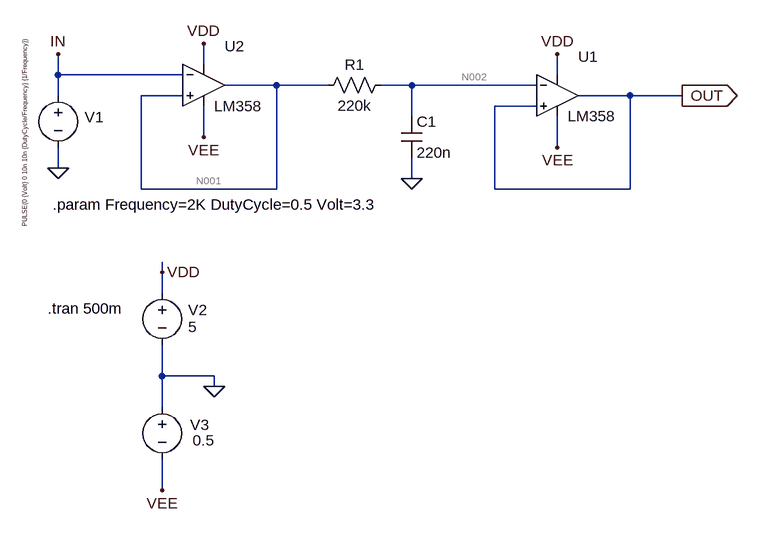
[diagram p0: schematic v1.0.asc]
v1.0.asc, the LTspice schematic file:
Version 4.1
SHEET 1 972 828
WIRE -48 80 -48 48
WIRE -272 96 -272 64
WIRE -80 96 -272 96
WIRE 496 96 496 64
WIRE 64 112 -16 112
WIRE 144 112 64 112
WIRE 272 112 224 112
WIRE 464 112 272 112
WIRE -272 128 -272 96
WIRE -80 128 -144 128
WIRE 608 128 528 128
WIRE 688 128 608 128
WIRE 464 144 400 144
WIRE 272 160 272 112
WIRE -48 192 -48 144
WIRE 496 208 496 160
WIRE -272 240 -272 208
WIRE 272 256 272 224
WIRE -144 272 -144 128
WIRE 64 272 64 112
WIRE 64 272 -144 272
WIRE 400 272 400 144
WIRE 608 272 608 128
WIRE 608 272 400 272
WIRE -112 400 -112 384
WIRE -112 432 -112 400
WIRE -112 560 -112 512
WIRE -32 560 -112 560
WIRE -32 576 -32 560
WIRE -112 608 -112 560
WIRE -112 736 -112 688
FLAG -272 240 0
FLAG 272 256 0
FLAG -272 64 IN
FLAG 688 128 OUT
IOPIN 688 128 Out
FLAG -112 400 VDD
FLAG 496 64 VDD
FLAG -48 48 VDD
FLAG -32 576 0
FLAG 496 208 VEE
FLAG -48 192 VEE
FLAG -112 736 VEE
SYMBOL voltage -272 112 R0
WINDOW 0 41 49 Left 2
WINDOW 3 -51 -74 VRight 0
WINDOW 123 0 0 Left 0
WINDOW 39 0 0 Left 0
SYMATTR InstName V1
SYMATTR Value PULSE(0 {Volt} 0 10n 10n {DutyCycle/Frequency} {1/Frequency})
SYMBOL res 240 96 R90
WINDOW 0 0 56 VBottom 2
WINDOW 3 32 56 VTop 2
SYMATTR InstName R1
SYMATTR Value 220k
SYMBOL cap 256 160 R0
SYMATTR InstName C1
SYMATTR Value 220n
SYMBOL voltage -112 416 R0
WINDOW 0 40 42 Left 2
WINDOW 3 40 68 Left 2
WINDOW 123 0 0 Left 0
WINDOW 39 0 0 Left 0
SYMATTR InstName V2
SYMATTR Value 5
SYMBOL MyLib\\OpAmp\\LM358 496 64 R0
WINDOW 0 32 4 Left 2
WINDOW 38 35 31 Left 2
SYMATTR InstName U1
SYMBOL MyLib\\OpAmp\\LM358 -48 48 R0
WINDOW 0 32 4 Left 2
WINDOW 38 35 31 Left 2
SYMATTR InstName U2
SYMBOL voltage -112 592 R0
WINDOW 0 43 43 Left 2
WINDOW 3 47 67 Left 2
WINDOW 123 0 0 Left 0
WINDOW 39 0 0 Left 0
SYMATTR InstName V3
SYMATTR Value 0.5
TEXT -280 296 Left 2 !.param Frequency=2K DutyCycle=0.5 Volt=3.3
TEXT -288 456 Left 2 !.tran 500m

The netlist it stands for:
* v1.0.asc
V1 IN 0 PULSE(0 {Volt} 0 10n 10n {DutyCycle/Frequency} {1/Frequency})
R1 N002 N001 220k
C1 N002 0 220n
V2 VDD 0 5
* U1: LM358 (symbol MyLib\OpAmp\LM358 not available, pins judged from their places): In+=OUT In-=N002 V+=VDD V-=VEE OUT=OUT
* U2: LM358 (symbol MyLib\OpAmp\LM358 not available, pins judged from their places): In+=N001 In-=IN V+=VDD V-=VEE OUT=N001
V3 0 VEE 0.5
.param Frequency=2K DutyCycle=0.5 Volt=3.3
.tran 500m
.backanno
.end

* Results of the author's LTspice run, read from the files saved beside the schematic
* Operating Point, zero values left out:
*   V(n001) = 22.38 µV
*   V(n002) = 2.223 mV
*   V(out) = 2.245 mV
*   V(vdd) = 5 V
*   V(vee) = -500 mV
*   I(R1) = 10 nA
*   I(V1) = 10 nA
*   I(V2) = -682.7 µA
*   I(V3) = -682.7 µA
*   Ix(u1:1) = -9.997 nA
*   Ix(u1:2) = -10 nA
*   Ix(u1:3) = 9.997 nA
*   Ix(u1:4) = 341.4 µA
*   Ix(u1:5) = -341.4 µA
*   Ix(u2:1) = -9.997 nA
*   Ix(u2:2) = -10 nA
*   Ix(u2:3) = 20 nA
*   Ix(u2:4) = 341.4 µA
*   Ix(u2:5) = -341.4 µA